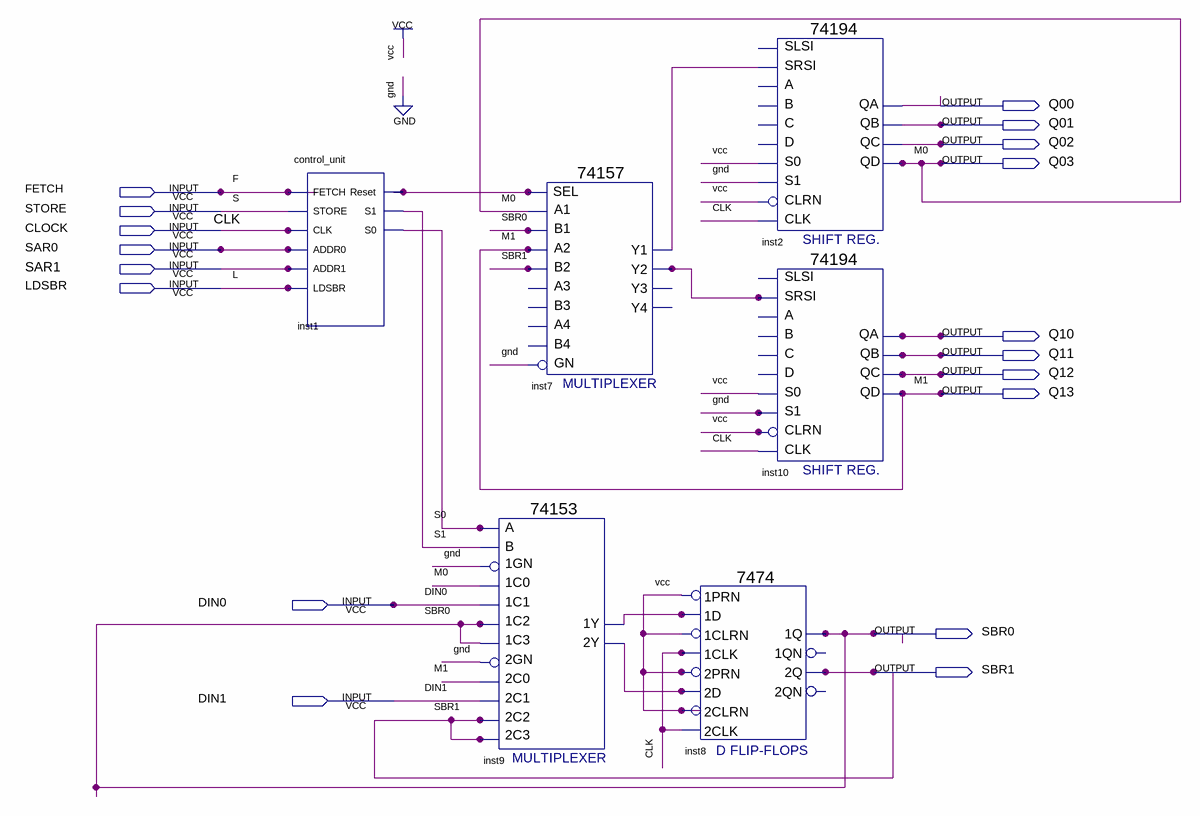
[diagram p0: schematic sheet]
// Quartus schematic Lab2.bdf as structural Verilog: 6 symbols, 18 pins
module Lab2 (
  input  FETCH,
  input  STORE,
  input  CLOCK,
  input  SAR0,
  input  SAR1,
  input  LDSBR,
  input  DIN0,
  input  DIN1,
  output Q00,
  output Q01,
  output Q02,
  output Q03,
  output Q10,
  output Q11,
  output Q12,
  output Q13,
  output SBR0,
  output SBR1
);

  wire inst1_reset, inst7_y1, inst7_y2, inst9_1y, inst9_2y, S0, S1;

  control_unit inst1 (
    .FETCH(FETCH), .STORE(STORE), .CLK(CLOCK), .ADDR0(SAR0), .ADDR1(SAR1), .LDSBR(LDSBR),
    .Reset(inst1_reset), .S1(S1), .S0(S0));
  \74153  inst9 (
    .\1C1 (DIN0), .\1GN (1'b0), .\1C0 (Q03), .\2C0 (Q13), .\2GN (1'b0), .\2C2 (SBR1), .\1C2 (SBR0),
    .\1C3 (SBR0), .B(S1), .A(S0), .\2C1 (DIN1), .\2C3 (SBR1), .\1Y (inst9_1y), .\2Y (inst9_2y));
  \74157  inst7 (
    .A1(Q03), .B1(SBR0), .SEL(inst1_reset), .B2(SBR1), .A2(Q13), .GN(1'b0), .Y2(inst7_y2), .Y1(inst7_y1));  // open: A3, B3, B4, A4, Y4, Y3
  \7474  inst8 (
    .\2D (inst9_2y), .\2PRN (1'b1), .\1CLK (CLOCK), .\1D (inst9_1y), .\1PRN (1'b1), .\2CLK (CLOCK),
    .\2CLRN (1'b1), .\1CLRN (1'b1), .\2Q (SBR1), .\1Q (SBR0));  // open: 1QN, 2QN
  \74194  inst2 (
    .SRSI(inst7_y1), .CLK(CLOCK), .CLRN(1'b1), .S1(1'b0), .S0(1'b1), .QA(Q00), .QB(Q01), .QC(Q02), .QD(Q03));  // open: SLSI, B, C, D, A
  \74194  inst10 (
    .SRSI(inst7_y2), .CLK(CLOCK), .CLRN(1'b1), .S1(1'b0), .S0(1'b1), .QA(Q10), .QB(Q11), .QC(Q12), .QD(Q13));  // open: SLSI, B, C, D, A

  // Other names for the same wires on the sheet: CLK = CLOCK; F = FETCH; L = LDSBR; M1 = Q13; M0 = Q03; S = STORE
endmodule
